# Altium schematic sheet J2.schdoc: TEBF0808 - B2B-connector J2
size A4; DocumentNumber: TEBF0808; Revision: 04; SheetNumber: 4; SheetTotal: 36; Date: 2016-09-29; CompanyName: Trenz Electronic GmbH; Organization: Trenz Electronic GmbH
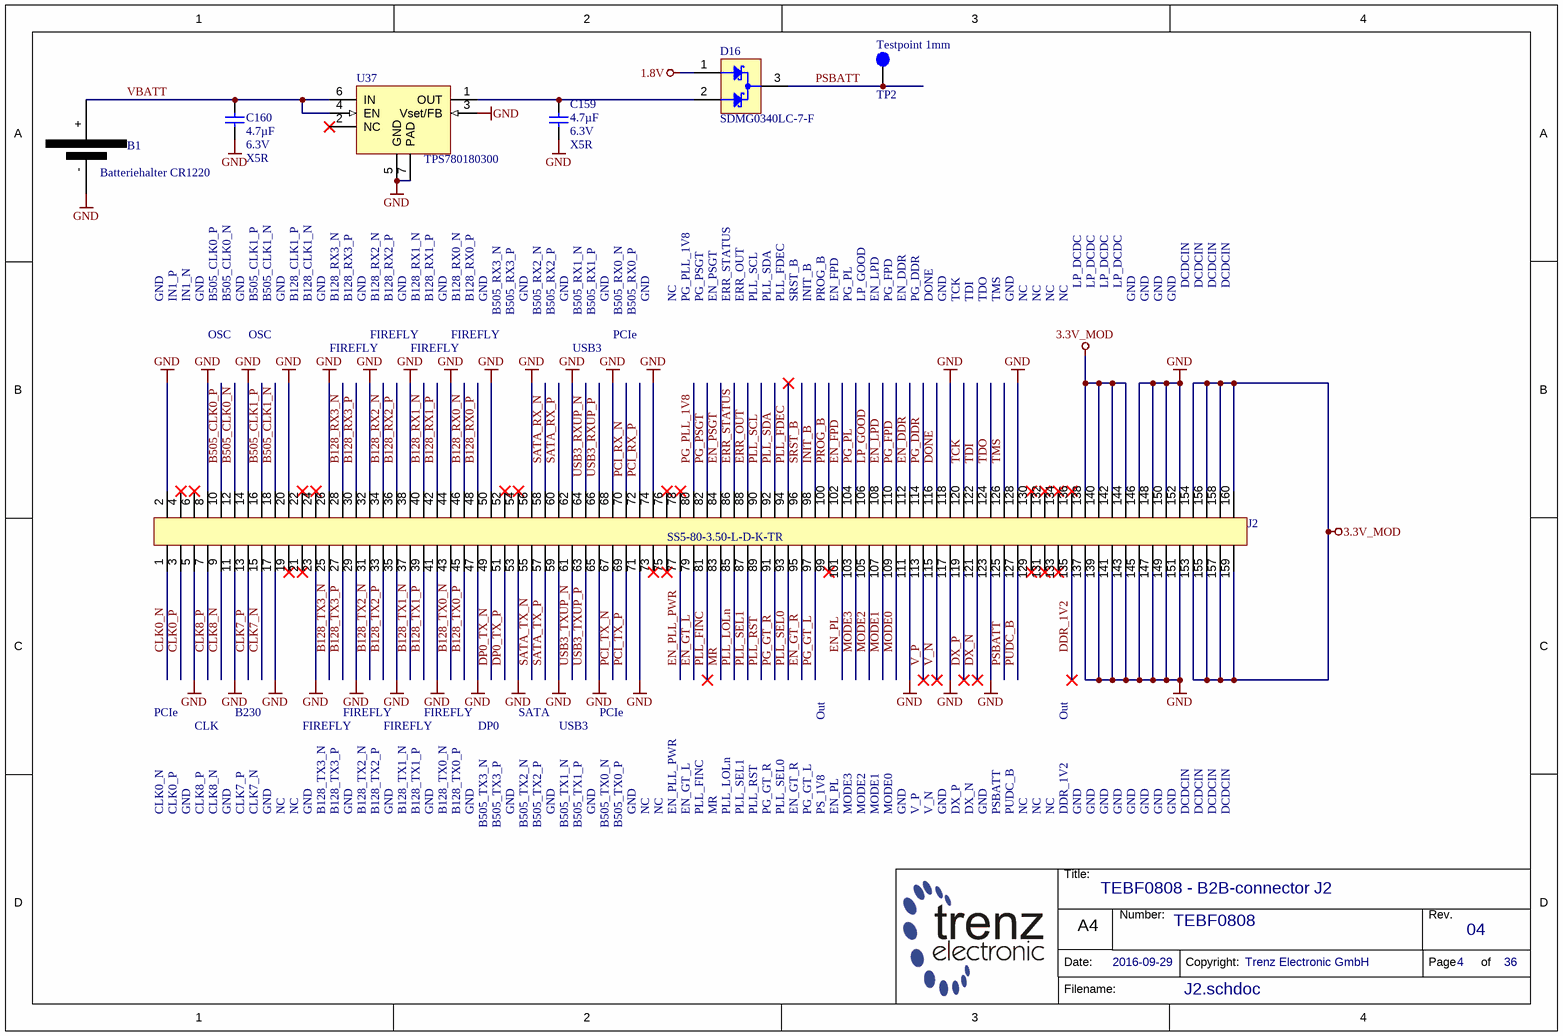
[diagram p0: J2.schdoc]

## Parts
B1  Batteriehalter CR1220  [CR1220]
C159  4.7µF  Voltage: 6.3V  Technology: X5R  [CAPC1005X60N]
C160  4.7µF  Voltage: 6.3V  Technology: X5R  [CAPC1005X60N]
D16  SDMG0340LC-7-F  [SOT65P210X110-3N]
J2  SS5-80-3.50-L-D-K-TR  [SS5-80-3.50-L-D-K-TR]
TP2  Testpoint 1mm  [TP_1mm]
U37  TPS780180300  [SON65P200X200X80-7N]

## Nets
1.8V: D16.1(A)
3.3V_MOD: J2.138 J2.140 J2.142 J2.144 J2.153 J2.154 J2.155 J2.156 J2.157 J2.158 J2.159 J2.160
GND: B1.- C159.2 C160.2 J2.2 J2.5 J2.8 J2.11 J2.14 J2.17 J2.20 J2.23 J2.26 J2.29 J2.32 J2.35 J2.38 J2.41 J2.44 J2.47 J2.50 J2.53 J2.56 J2.59 J2.62 J2.65 J2.68 J2.71 J2.74 J2.111 J2.117 J2.118 J2.123 J2.128 J2.137 J2.139 J2.141 J2.143 J2.145 J2.146 J2.147 J2.148 J2.149 J2.150 J2.151 J2.152 U37.3(Vset/FB) U37.5(GND) U37.7(PAD)
B128_RX0_N: J2.46
B128_RX0_P: J2.48
B128_RX1_N: J2.40
B128_RX1_P: J2.42
B128_RX2_N: J2.34
B128_RX2_P: J2.36
B128_RX3_N: J2.28
B128_RX3_P: J2.30
B128_TX0_N: J2.43
B128_TX0_P: J2.45
B128_TX1_N: J2.37
B128_TX1_P: J2.39
B128_TX2_N: J2.31
B128_TX2_P: J2.33
B128_TX3_N: J2.25
B128_TX3_P: J2.27
B505_CLK0_N: J2.12
B505_CLK0_P: J2.10
B505_CLK1_N: J2.18
B505_CLK1_P: J2.16
CLK0_N: J2.1
CLK0_P: J2.3
CLK7_N: J2.15
CLK7_P: J2.13
CLK8_N: J2.9
CLK8_P: J2.7
DDR_1V2: J2.135
DONE: J2.116
DP0_TX_N: J2.49
DP0_TX_P: J2.51
DX_N: J2.121
DX_P: J2.119
EN_DDR: J2.112
EN_FPD: J2.102
EN_GT_L: J2.79
EN_GT_R: J2.95
EN_LPD: J2.108
EN_PL: J2.101
EN_PLL_PWR: J2.77
EN_PSGT: J2.84
ERR_OUT: J2.88
ERR_STATUS: J2.86
INIT_B: J2.98
LP_GOOD: J2.106
MODE0: J2.109
MODE1: J2.107
MODE2: J2.105
MODE3: J2.103
MR: J2.83
PCI_RX_N: J2.70
PCI_RX_P: J2.72
PCI_TX_N: J2.67
PCI_TX_P: J2.69
PG_DDR: J2.114
PG_FPD: J2.110
PG_GT_L: J2.97
PG_GT_R: J2.91
PG_PL: J2.104
PG_PLL_1V8: J2.80
PG_PSGT: J2.82
PLL_FDEC: J2.94
PLL_FINC: J2.81
PLL_LOLn: J2.85
PLL_RST: J2.89
PLL_SCL: J2.90
PLL_SDA: J2.92
PLL_SEL0: J2.93
PLL_SEL1: J2.87
PROG_B: J2.100
PSBATT: D16.3(K) J2.125 TP2.1
PUDC_B: J2.127
SATA_RX_N: J2.58
SATA_RX_P: J2.60
SATA_TX_N: J2.55
SATA_TX_P: J2.57
SRST_B: J2.96
TCK: J2.120
TDI: J2.122
TDO: J2.124
TMS: J2.126
USB3_RXUP_N: J2.64
USB3_RXUP_P: J2.66
USB3_TXUP_N: J2.61
USB3_TXUP_P: J2.63
V_N: J2.115
V_P: J2.113
VBATT: B1.+ C160.1 U37.4(EN) U37.6(IN)
NetC159_1: C159.1 D16.2(A) U37.1(OUT)

Not connected (* = marked no-connect by the designer): J2 4* 6* 19* 21* 22* 24* 52* 54* 73* 75* 76* 78* 99* 129* 130* 131* 132* 133* 134* 136*; U37 2(NC)*

## Notes on the sheet
- GND
- IN1_P
- IN1_N
- B505_CLK0_P
- B505_CLK0_N
- B505_CLK1_P
- B505_CLK1_N
- B128_CLK1_P
- B128_CLK1_N
- B128_RX3_N
- B128_RX3_P
- B128_RX2_N
- B128_RX2_P
- B128_RX1_N
- B128_RX1_P
- B128_RX0_N
- B128_RX0_P
- B505_RX3_N
- B505_RX3_P
- B505_RX2_N
- B505_RX2_P
- B505_RX1_N
- B505_RX1_P
- B505_RX0_N
- B505_RX0_P
- NC
- PG_PLL_1V8
- PG_PSGT
- EN_PSGT
- ERR_STATUS
- ERR_OUT
- PLL_SCL
- PLL_SDA
- PLL_FDEC
- SRST_B
- INIT_B
- PROG_B
- EN_FPD
- PG_PL
- LP_GOOD
- EN_LPD
- PG_FPD
- EN_DDR
- PG_DDR
- DONE
- TCK
- TDI
- TDO
- TMS
- LP_DCDC
- DCDCIN
- OSC
- FIREFLY
- USB3
- PCIe
- B230
- SATA
- Out
- CLK
- DP0
- CLK0_N
- CLK0_P
- CLK8_P
- CLK8_N
- CLK7_P
- CLK7_N
- B128_TX3_N
- B128_TX3_P
- B128_TX2_N
- B128_TX2_P
- B128_TX1_N
- B128_TX1_P
- B128_TX0_N
- B128_TX0_P
- B505_TX3_N
- B505_TX3_P
- B505_TX2_N
- B505_TX2_P
- B505_TX1_N
- B505_TX1_P
- B505_TX0_N
- B505_TX0_P
- EN_PLL_PWR
- EN_GT_L
- PLL_FINC
- MR
- PLL_LOLn
- PLL_SEL1
- PLL_RST
- PG_GT_R
- PLL_SEL0
- EN_GT_R
- PG_GT_L
- PS_1V8
- EN_PL
- MODE3
- MODE2
- MODE1
- MODE0
- V_P
- V_N
- DX_P
- DX_N
- PSBATT
- PUDC_B
- DDR_1V2
- Title:
- Number:
- Rev.
- Date:
- A4
- Copyright:
- Page
- of
- Filename:

## Library data of the parts
B1 = 25140: AN: 25140; Mixed: SMT; Trenz-Stock: Yes; H-ART: BC501SM; Case: CD1220; HelpURL: B:\AD\adlib\datasheet\BC501SM
C159 C160 = 24719: KON 4.7µF 6.3V X5R SMD 20%; AN: 24719; Value: 4.7u; Mixed: SMT; Preferred: Yes; Case: 1005 (0402); Tolerance: 20%
D16 = 25051: AN: 25051; Mixed: SMT; Trenz-Stock: Yes; Case: SC70-3 / SOT323; HelpURL: B:\AD\adlib\datasheet\SDMG0340; H-ART: SDMG0340LC-7-F
J2 = 27219: Samtec Ultra Fine Pitch Socket REF192552-01, 160 Pins; AN: 27219; Mixed: SMT; Preferred: Yes; HelpURL: B:\ad\adlib\datasheet\SS5-XX-X.XX-X-D-K-TR; H-ART: REF 192552-01
TP2 = 25063: AN: 25063; Mixed: SMT
U37 = 25062: AN: 25062; Trenz-Stock: Yes; Mixed: SMT; Case: DRV; HelpURL: B:\AD\adlib\datasheet\TPS780; H-ART: TPS780180300